# EAGLE board KickerBoard-new (EAGLE 9.3.0), part 1 of 2
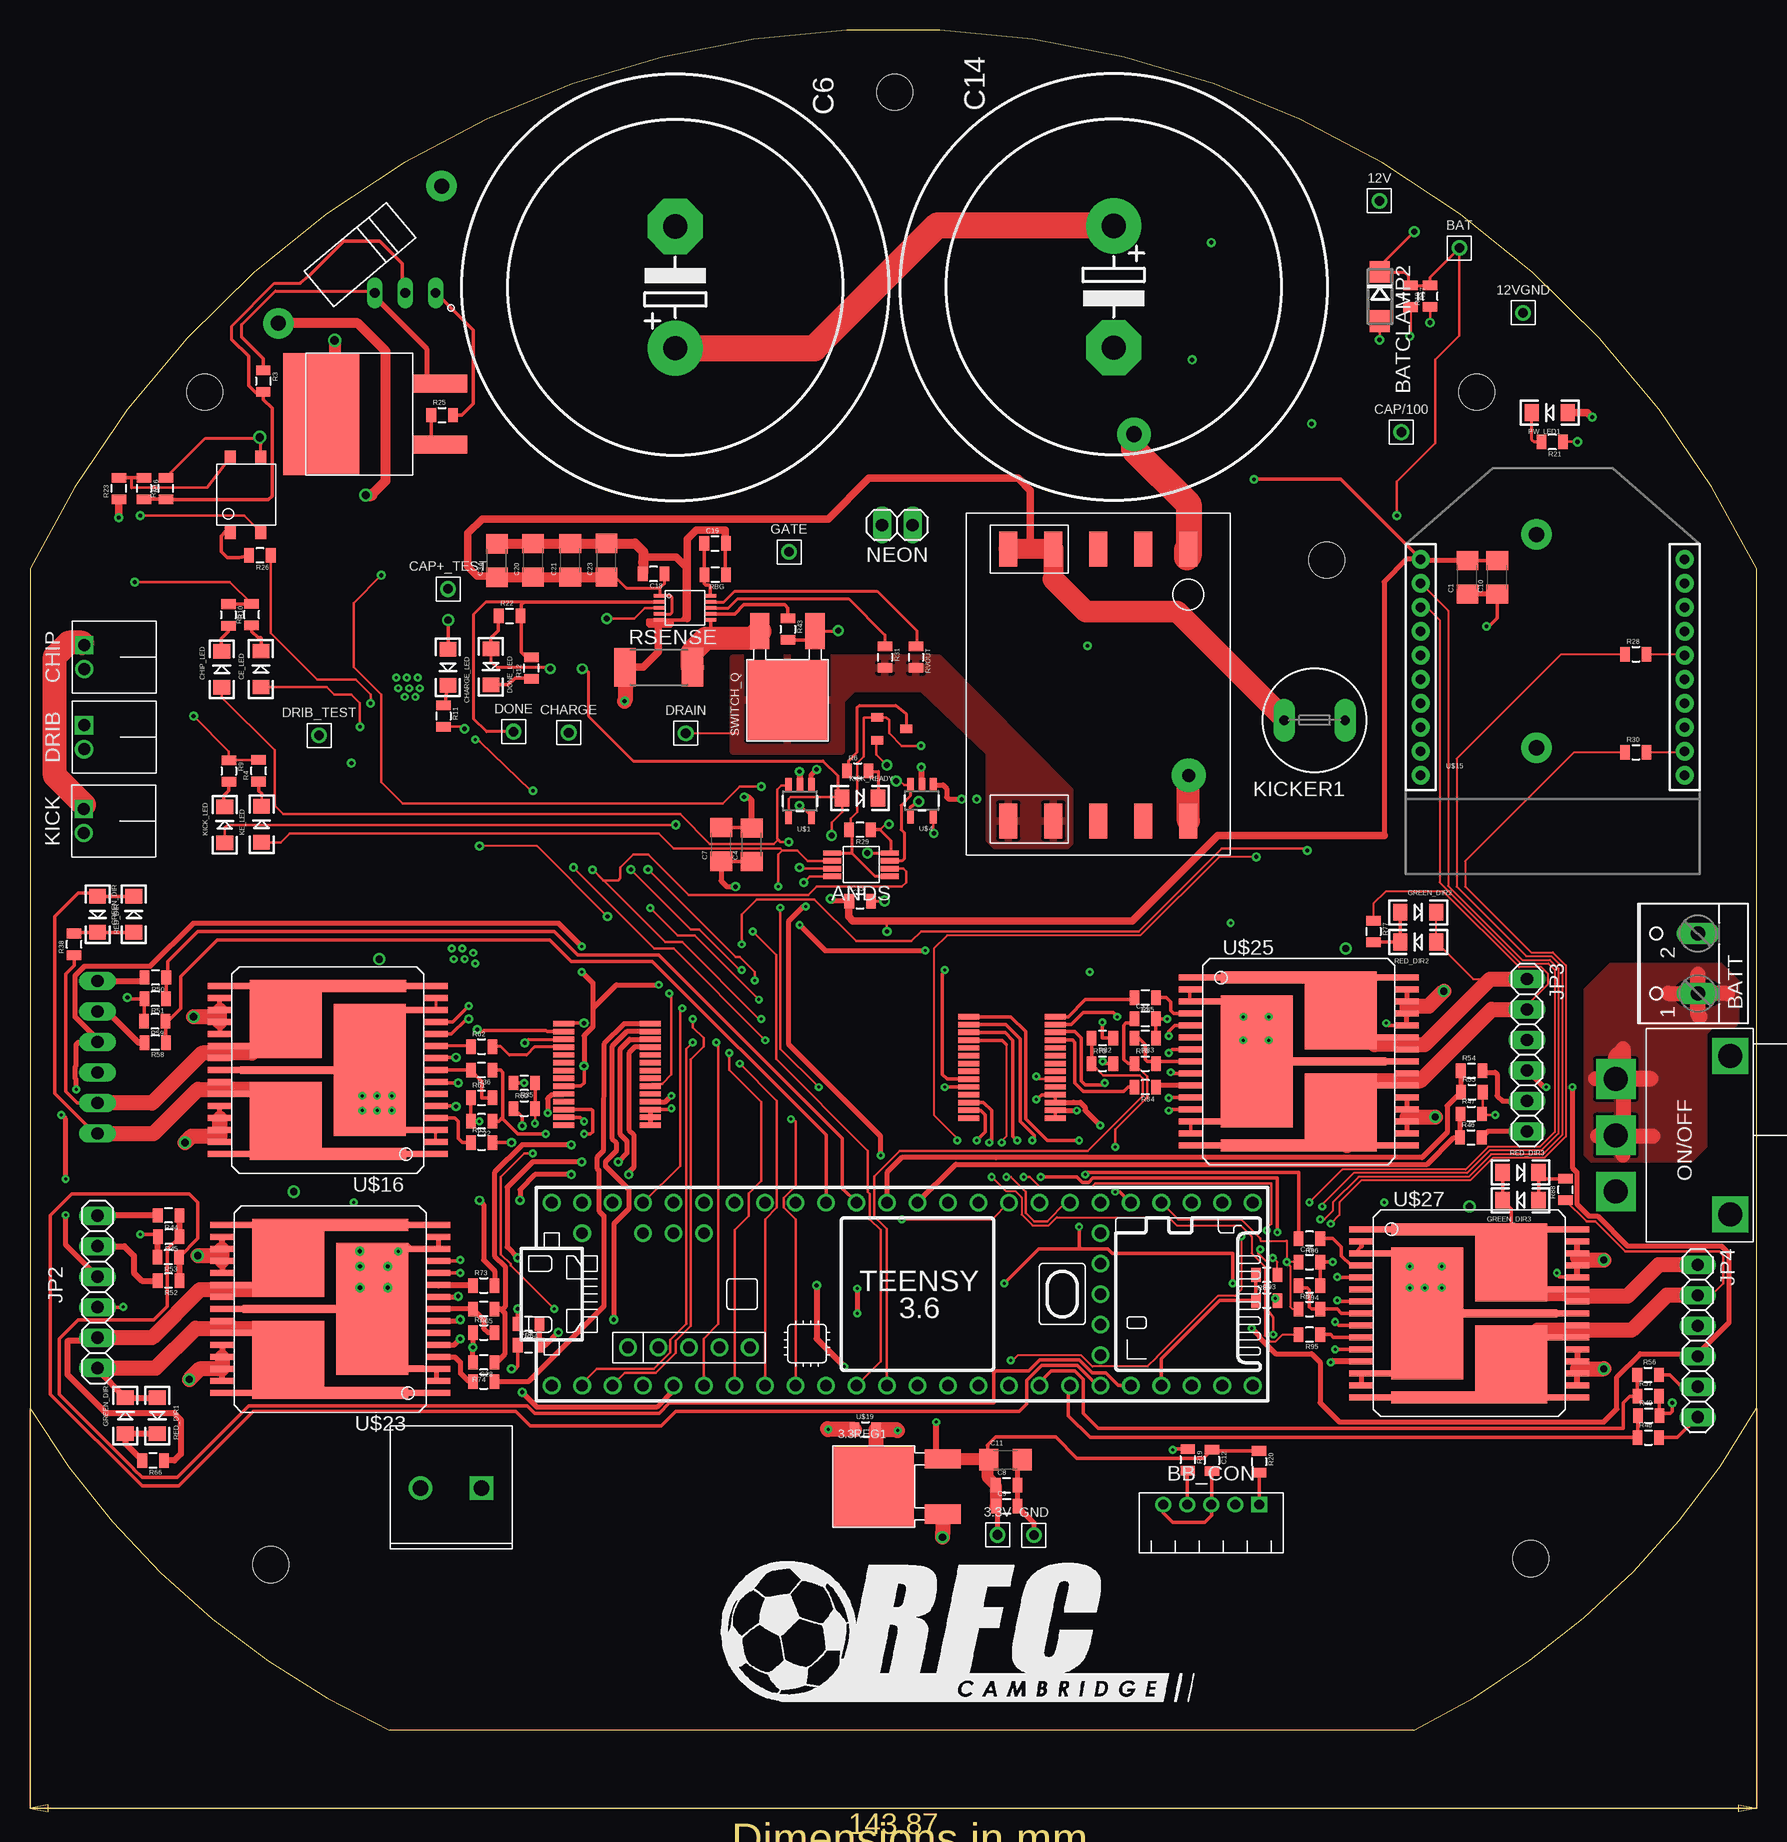
[diagram p3: board, top side]
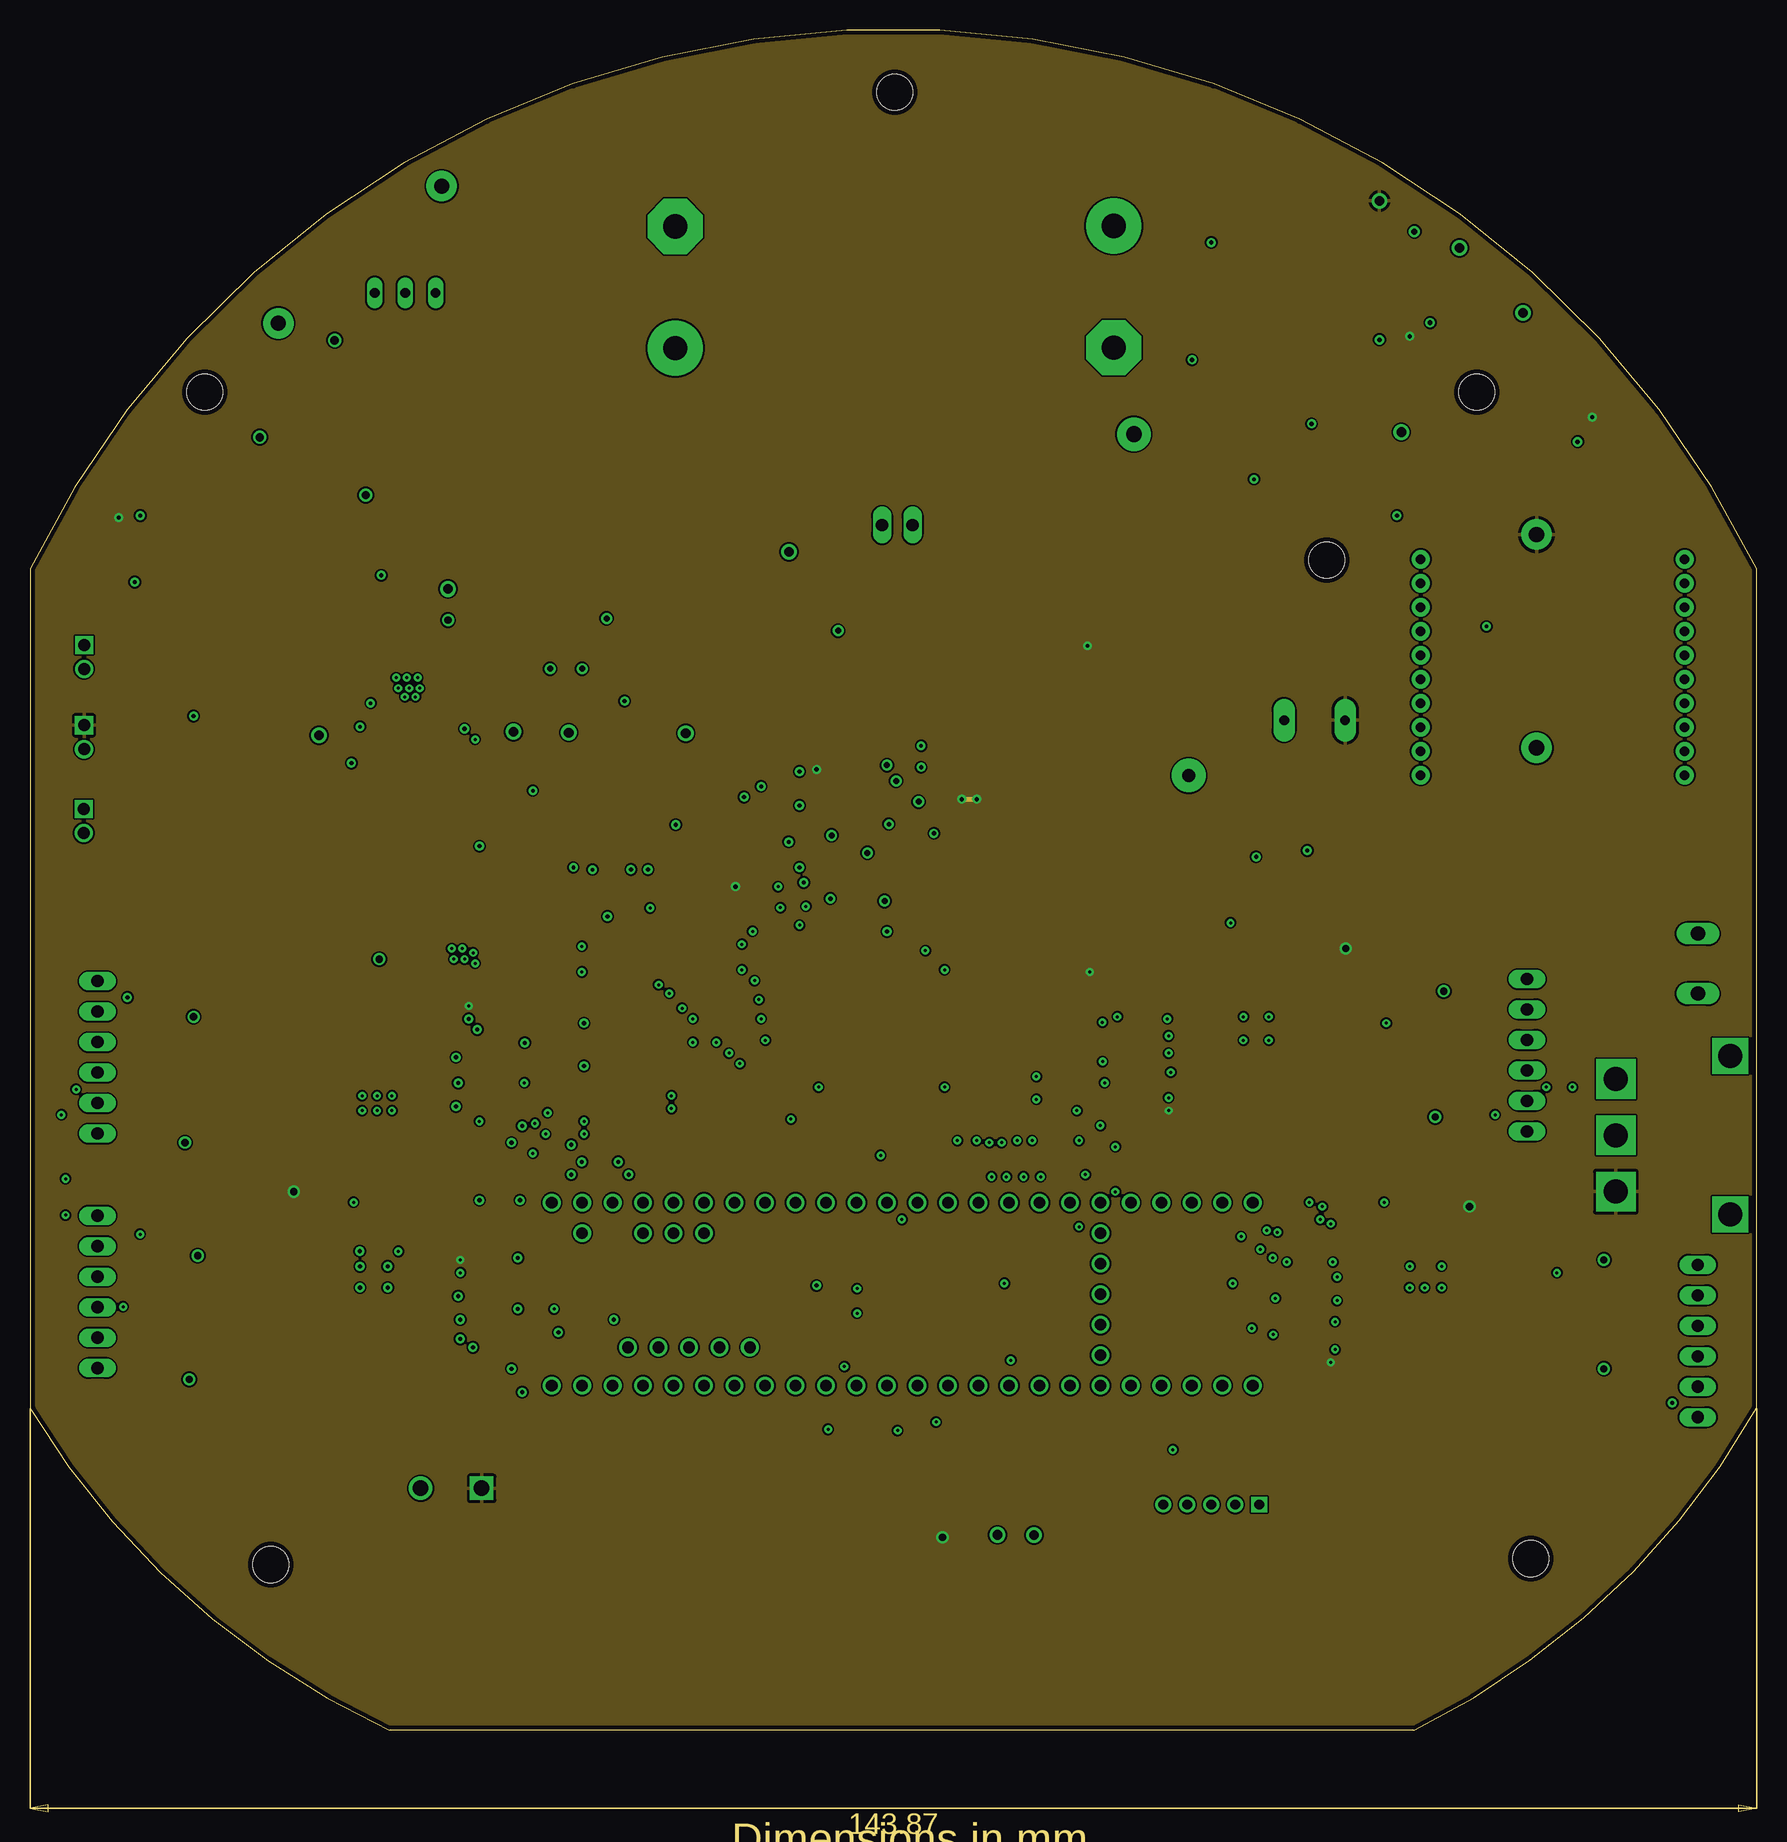
[diagram p4: board, inner layer 12V+]
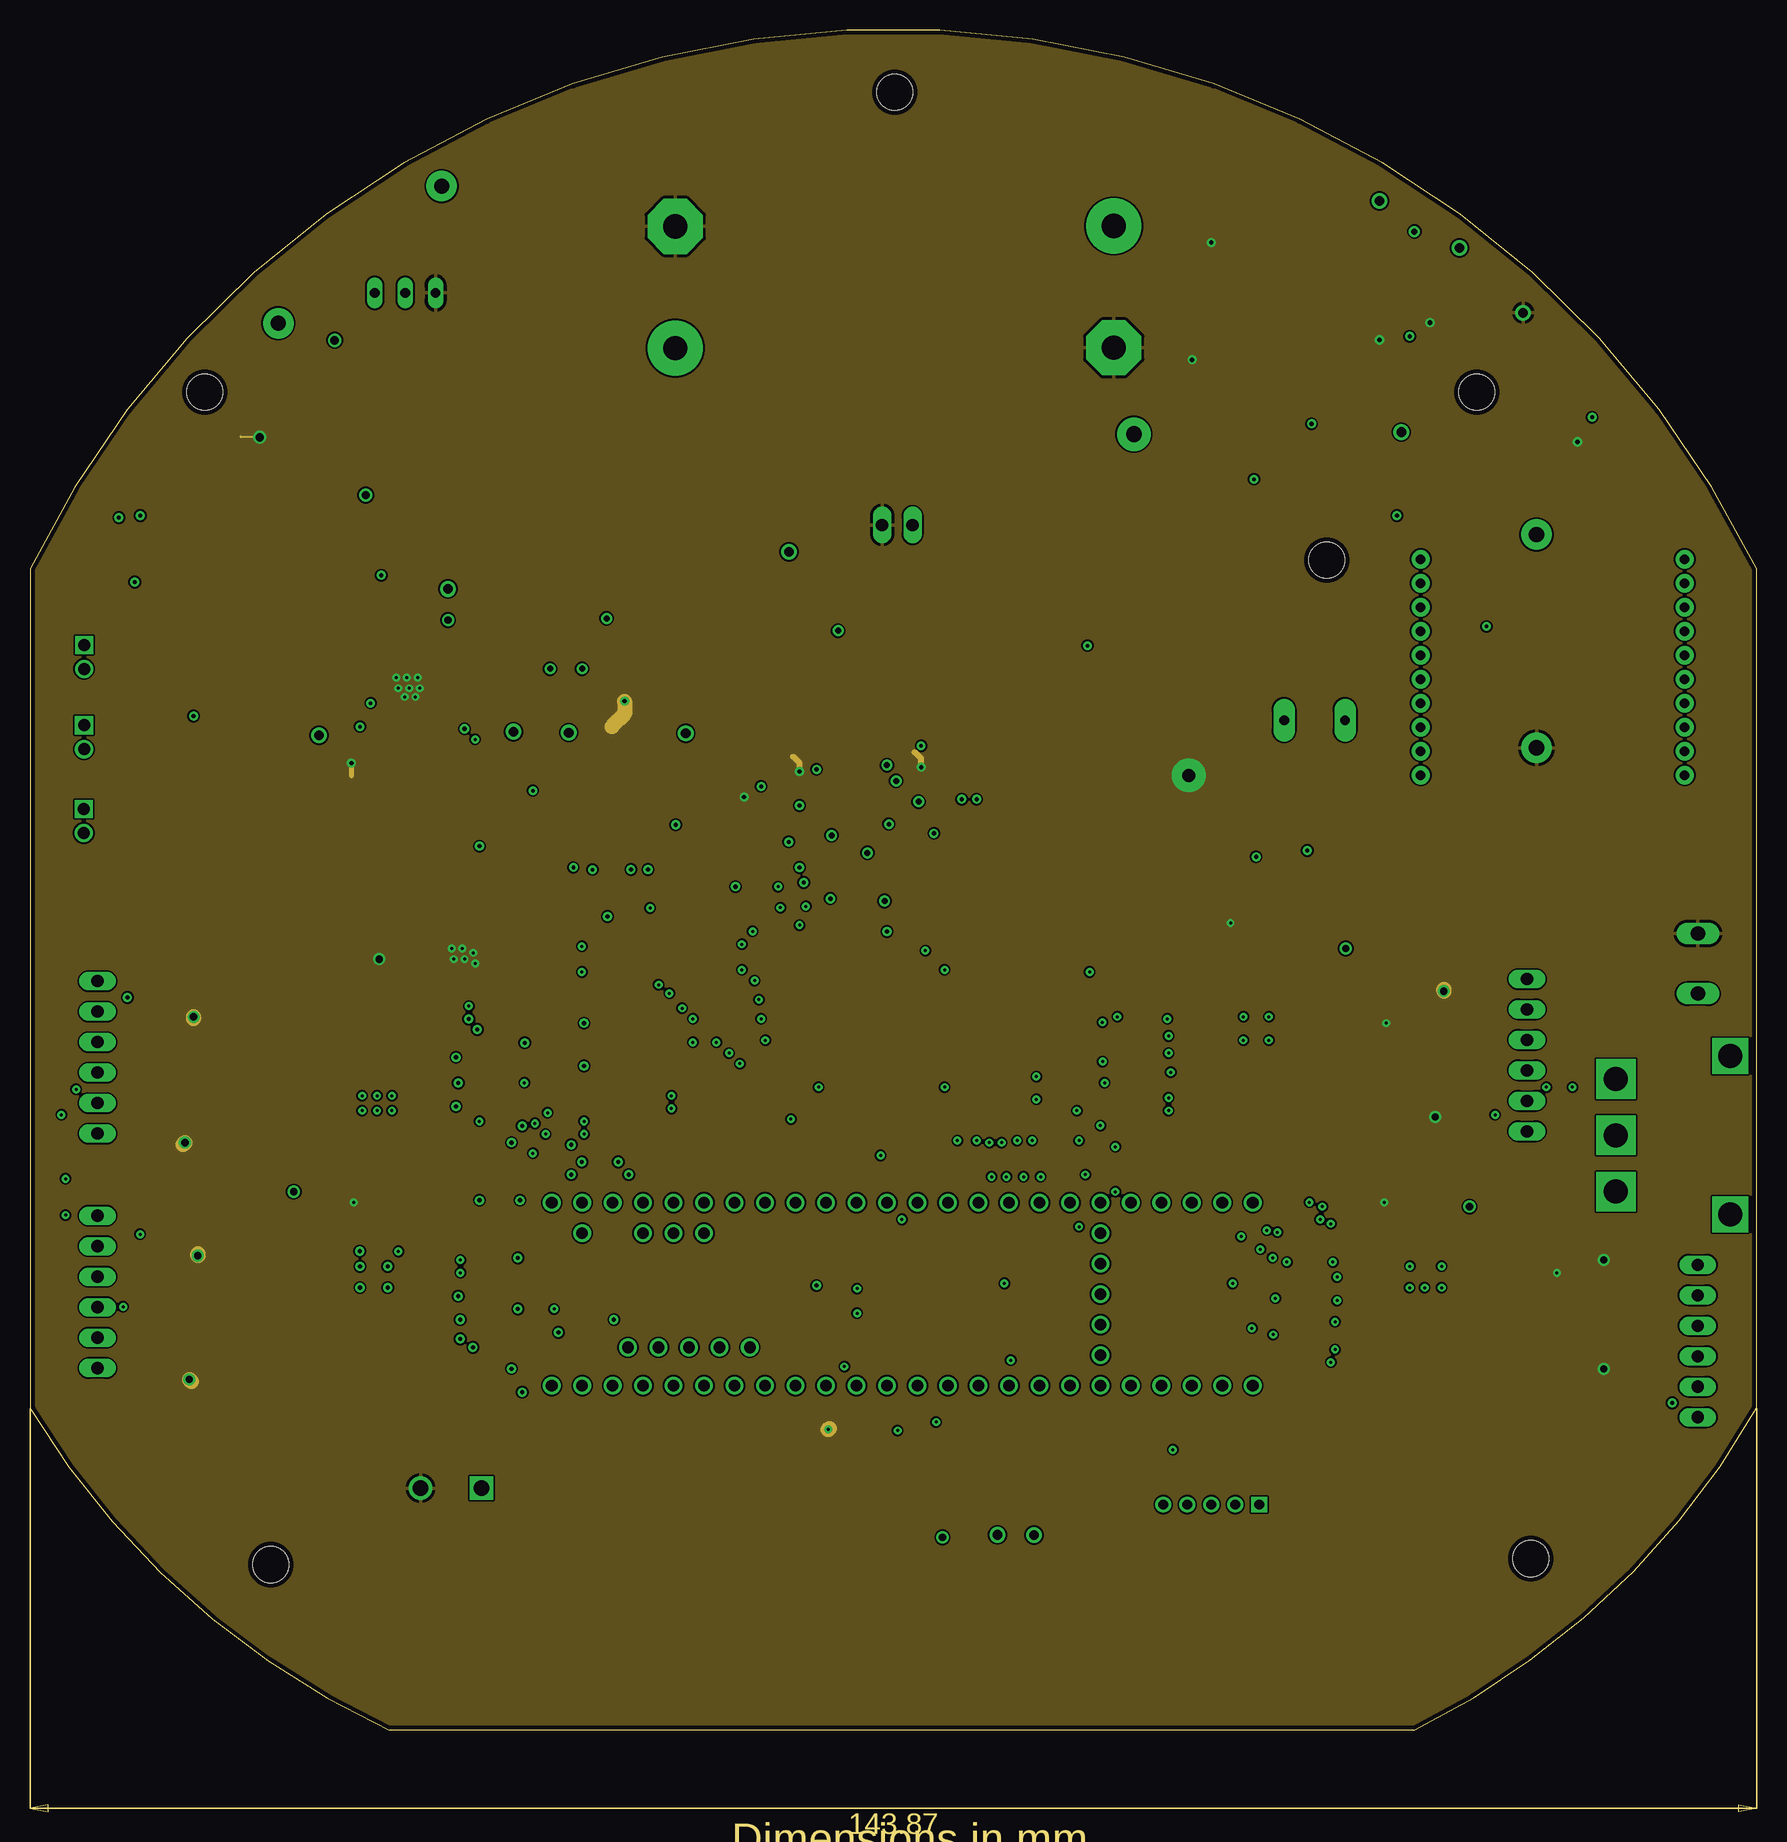
[diagram p5: board, inner layer 12VGND]
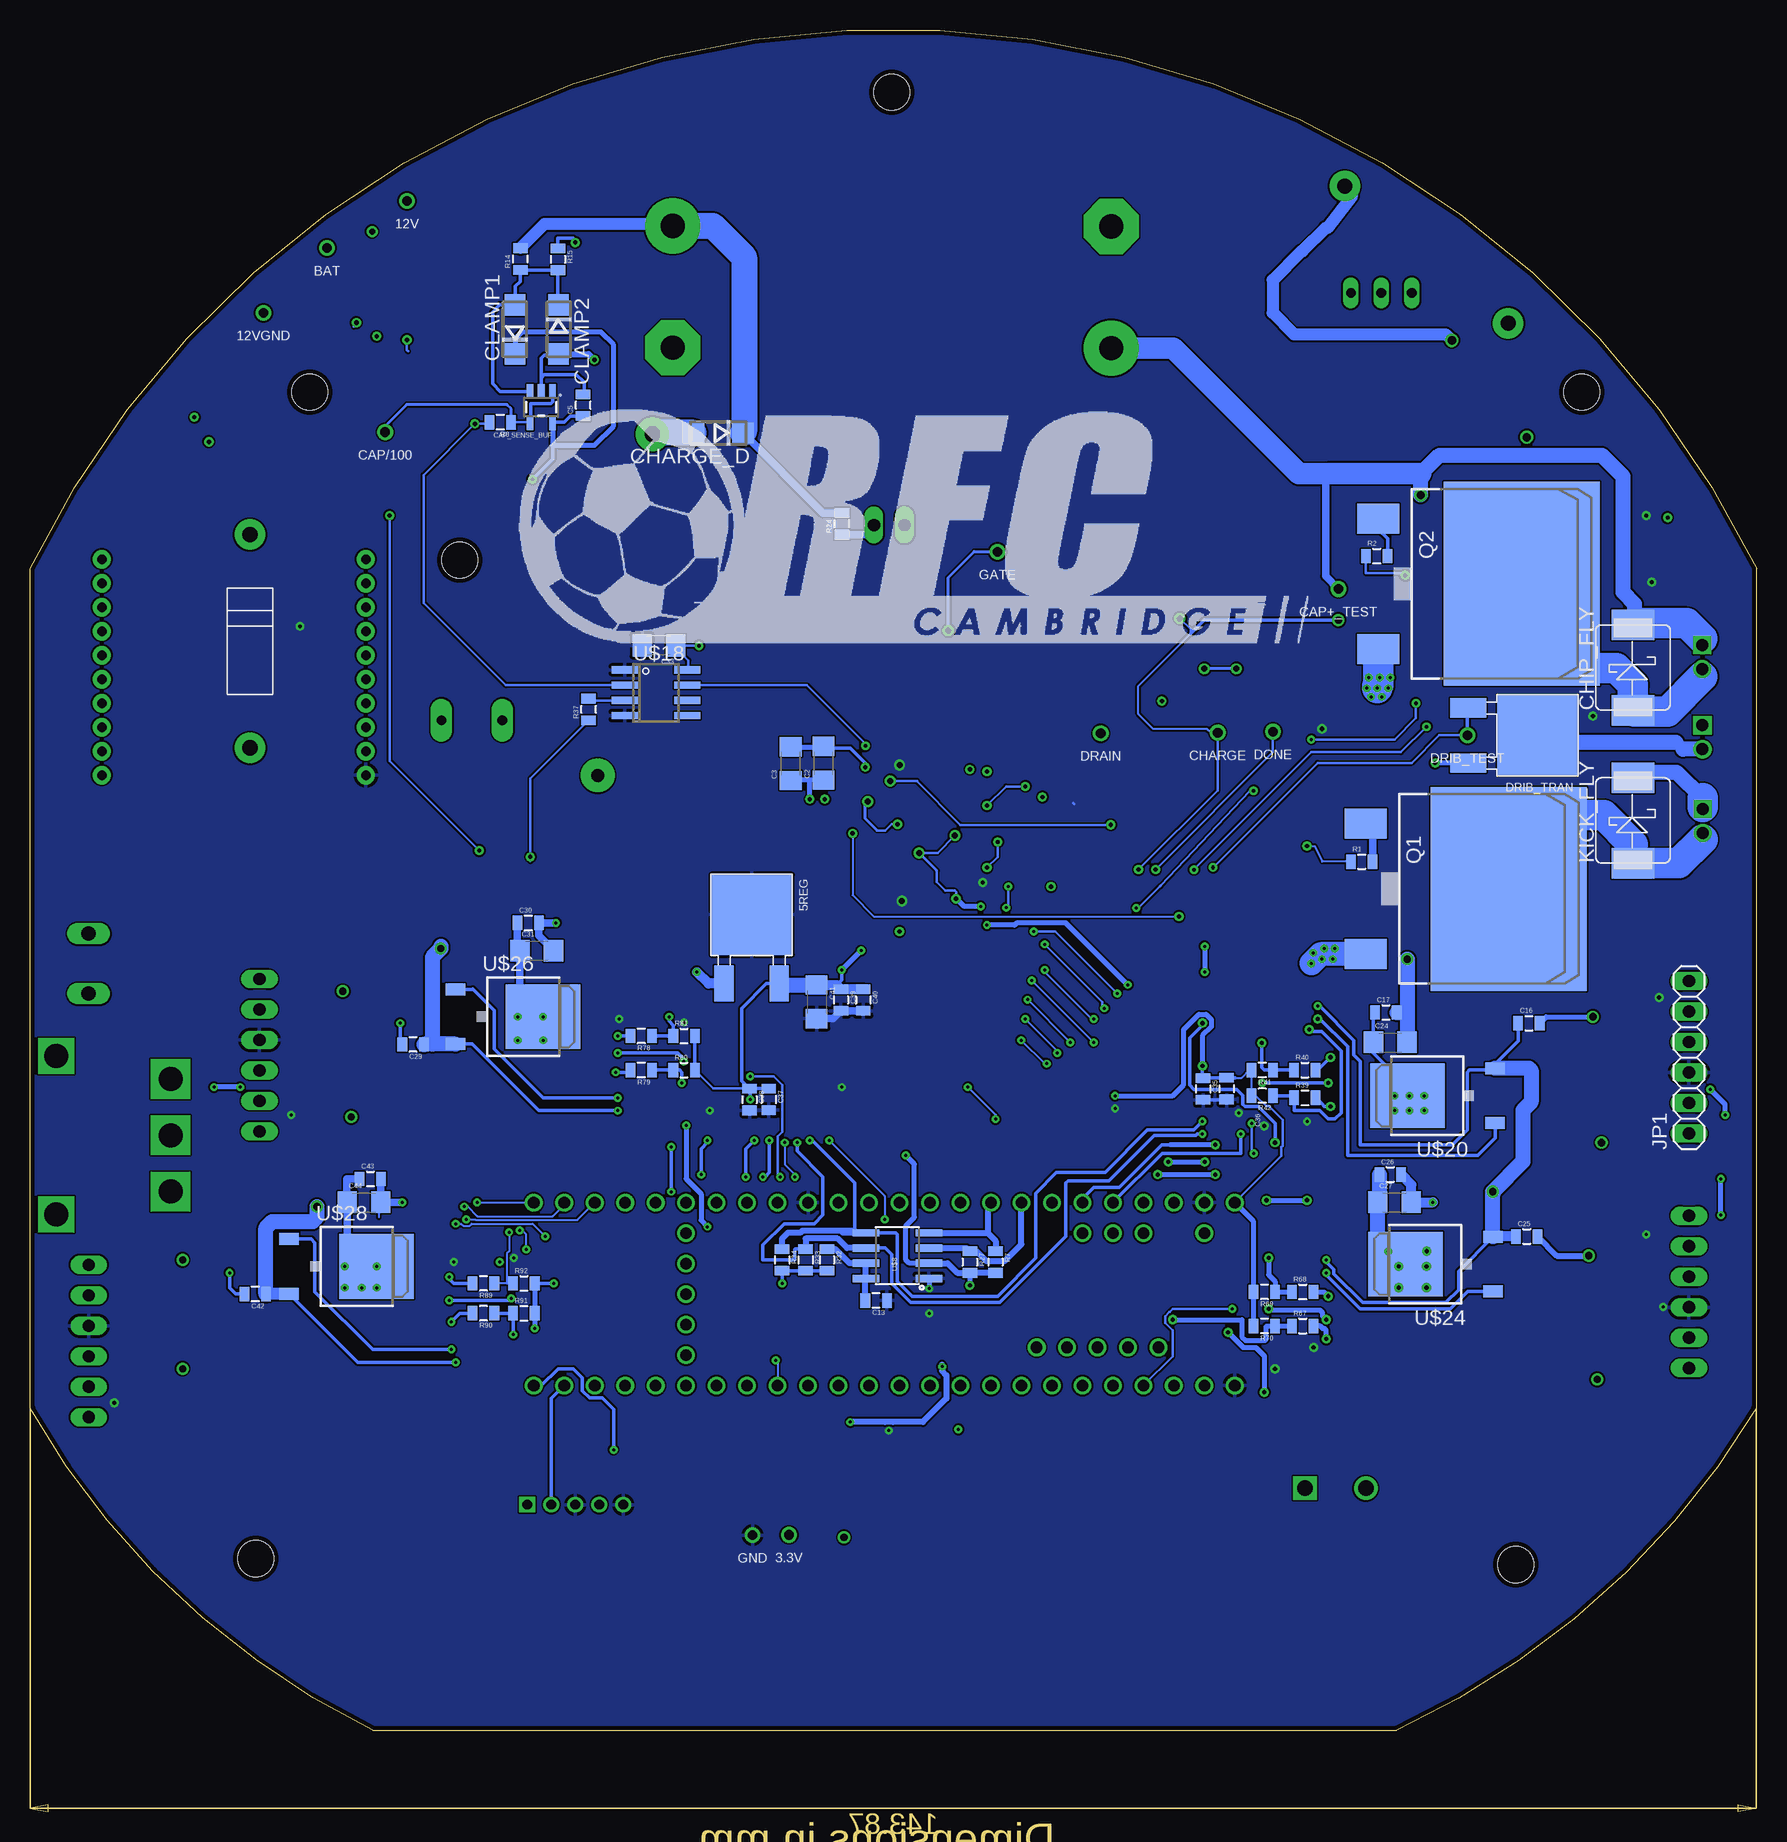
[diagram p6: board, bottom side, seen from below]

Size 143.88 x 141.72 mm. Coordinates in mm from the lower left corner, seen from the top.
Outline: 143.88,26.82 143.88,96.81 arc128 0,96.81 0,26.82 arc34 29.98,0 115.32,0 arc34 143.88,26.82
Copper layers (1*2*3*16): Top(3v3+) 0.035559375mm / dielectric 0.62mm / 12V+ 0.035559375mm / dielectric 0.62mm / 12VGND 0.035559375mm / dielectric 0.62mm / Bottom(3v3GND) 0.035559375mm
Design rules "typical_4pcb *": minimum track width 6mil, minimum drill 8mil, track to track 6mil, track to pad 6mil, pad to pad 6mil, via to via 6mil, smd to smd 6mil, copper to edge 15mil, drill to drill 8mil, minimum pad ring 10mil, minimum via ring 8mil, stop-mask expansion 4mil, vias tented up to drill 0mil, thermal gap 10mil
Holes 3 mm at 125.07,14.3 20.07,13.8 14.57,111.52 72.07,136.52 108.07,97.52 120.57,111.52

## Footprints (pad centres in the part's own frame; a part is rotated, then mirrored left to right if it is on the bottom)
DPAK = smd 6.7 x 6.7: DRAIN 0,0 | smd 3 x 1.6: GATE 5.75,-2.3; SOURCE 5.75,2.3
TESTING_PT = drill 0.8: P$1 0,0
TSSOP8 = smd 1.5 x 0.45: P$1 -2.4,0.975; P$2 -2.4,0.325; P$3 -2.4,-0.325; P$4 -2.4,-0.975; P$5 2.4,-0.975; P$6 2.4,-0.325; P$7 2.4,0.325; P$8 2.4,0.975
DO214AC = smd 1.8 x 1.7: A 2.05,0; C -2.05,0
W237-102 = drill 1.194 long: 1 -2.5,-1.27; 2 2.5,-1.27
JST-5-2MM = drill 0.8 square: 1 4,0 | drill 0.8: 2 2,0; 3 0,0; 4 -2,0; 5 -4,0
1206 = smd 1.6 x 1.8: 1 -1.4,0; 2 1.4,0
0805 = smd 0.8 x 1.2: 1 -0.9,0; 2 0.9,0
EB35D = drill 2.007 pad 4.597: + -5.08,0 | drill 2.007 pad 4.597 octagon: - 5.08,0
SOT23-5 = smd 0.55 x 1.2: 1 -0.95,-1.3; 2 0,-1.3; 3 0.95,-1.3; 4 0.95,1.3; 5 -0.95,1.3
LED-1206 = smd 1.2 x 1.4: A -1.5,0; C 1.5,0
10-MSOP = smd 0.97 x 0.31: P$1 -0.485,-0.155; P$2 -0.485,-0.655; P$3 -0.485,-1.155; P$4 -0.485,-1.655; P$5 -0.485,-2.155; P$6 3.785,-2.155; P$7 3.785,-1.655; P$8 3.785,-1.155; P$9 3.785,-0.655; P$10 3.785,-0.155
JST-2-2MM = drill 1 square: 1 1,1 | drill 1: 2 -1,1
DO214AB = smd 2.54 x 3.556: ANODE 0,3.111; CATHODE 7.112,3.111
1X06 = drill 1.016 long: 1 -6.35,0; 2 -3.81,0; 3 -1.27,0; 4 1.27,0; 5 3.81,0; 6 6.35,0
TR5 = drill 0.813 pad 1.778 long: 1 -2.54,0; 2 2.54,0
1X02 = drill 1.016 long: 1 -1.27,0; 2 1.27,0
CK_SWITCH = drill 2 pad 3.302 square: COM 0,0; IN1 4.699,0; IN2 -4.699,0 | drill 2 pad 2.54 square: SUP1 -6.604,-9.525; SUP2 6.604,-9.525
TO268 = smd 8.5 x 13: C@1 -4.25,2.25; C@2 4.25,2.25 | smd 2.5 x 3.5: E 5.45,-9.7; G -5.45,-9.7
R2512 = smd 1.8 x 3.2: 1 -2.8,0; 2 2.8,0
TO-263 = smd 1.524 x 4.572: LOWER_LEFT 2.54,-2.286; LOWER_RIGHT 7.62,-2.286 | smd 10.16 x 6.35: TAB 5.08,7.62
10-TRANSFORMER = smd 2.92 x 1.52: P$1 0,0; P$2 0,-3.75; P$3 0,-7.5; P$4 0,-11.25; P$5 0,-15; P$6 22.67,-15; P$7 22.67,-11.25; P$8 22.67,-7.5; P$9 22.67,-3.75; P$10 22.67,0
SOP4 = smd 0.889 x 1.143: 1 0.813,-0.584; 2 3.353,-0.584; 3 3.353,5.664; 4 0.813,5.639
TO92 = drill 0.8 long: CENTER 2.54,0; LEFT 0,0; RIGHT 5.08,0
THROUGH-HOLE-2 = drill 1.27 pad 2.54: + 0,0; - 17.78,0
SOIC8 = smd 0.61 x 2.21: 1 -1.905,-2.616; 2 -0.635,-2.616; 3 0.635,-2.616; 4 1.905,-2.616; 5 1.905,2.616; 6 0.635,2.616; 7 -0.635,2.616; 8 -1.905,2.616
1X02-PHEONIX = drill 1.3 square: 1 0,0 | drill 1.3: 2 5.08,0
TEENSY_3.5/3.6 = drill 0.965: 0/RX -25.4,-7.62; 1/TX -22.86,-7.62; 2 -20.32,-7.62; 3/CANTX -17.78,-7.62; 3V3 7.62,-7.62; 3V3_2 17.78,-2.54; 3V3_LO -22.86,7.62; 4/CANRX -15.24,-7.62; 5 -12.7,-7.62; 6 -10.16,-7.62; 7 -7.62,-7.62; 8 -5.08,-7.62; 9/CS -2.54,-7.62; 10/CS 0,-7.62; 11/MOSI 2.54,-7.62; 12/MISO 5.08,-7.62; 13/SCK 5.08,7.62; 14/A0 2.54,7.62; 15/A1 0,7.62; 16/A2 -2.54,7.62; 17/A3 -5.08,7.62; 18/A4/SDA -7.62,7.62; 19/A5/SCL -10.16,7.62; 20/A6 -12.7,7.62; 21/A7 -15.24,7.62; 21/DAC0 12.7,7.62; 22/A8 -17.78,7.62; 23/A9 -20.32,7.62; 24 10.16,-7.62; 25 12.7,-7.62; 26 15.24,-7.62; 27 17.78,-7.62; 28 20.32,-7.62; 29 22.86,-7.62; 30 25.4,-7.62; 31/A12 27.94,-7.62; 32/A13 30.48,-7.62; 33/A14 30.48,7.62; 34/A15 27.94,7.62; 35/A16 25.4,7.62; 36/A17 22.86,7.62; 37/A18 20.32,7.62; 38/A19 17.78,7.62; 39/A20 15.24,7.62; A10 -17.78,5.08; A11 -15.24,5.08; A22/DAC1 10.16,7.62; AGND -25.4,7.62; AREF -20.32,5.08; GND -27.94,-7.62; GND2 7.62,7.62; GND3 17.78,0; PROG 17.78,2.54; RESET 17.78,5.08; U5V -21.59,-4.445; UD+ -16.51,-4.445; UD- -19.05,-4.445; UGND1 -13.97,-4.445; UGND2 -11.43,-4.445; VBAT 17.78,-5.08; VIN -27.94,7.62; VUSB -25.4,5.08
XBEE-1 = drill 0.8 pad 1.524: 1 -11,20; 2 -11,18; 3 -11,16; 4 -11,14; 5 -11,12; 6 -11,10; 7 -11,8; 8 -11,6; 9 -11,4; 10 -11,2; 11 11,2; 12 11,4; 13 11,6; 14 11,8; 15 11,10; 16 11,12; 17 11,14; 18 11,16; 19 11,18; 20 11,20
MULTIPOWERSO-30 = smd 0.508 x 12: 1 -7,-4; 15 7,-4; 16 7,4; 30 -7,4 | smd 0.508 x 2: 2 -6,-9; 4 -4,-9; 5 -3,-9; 6 -2,-9; 7 -1,-9; 8 0,-9; 9 1,-9; 10 2,-9; 11 3,-9; 12 4,-9; 14 6,-9; 17 6,9; 18 5,9; 19 4,9; 20 3,9; 22 1,9; 24 -1,9; 26 -3,9; 27 -4,9; 28 -5,9; 29 -6,9 | smd 0.508 x 4: 3 -5,-8; 13 5,-8; 21 2,8; 23 0,8; 25 -2,8 | smd 6.5 x 6: OUTA -4.25,3.5; OUTB 4.25,3.5 | smd 1 x 7.5: OUTA@1 -7,-2.755; OUTB@1 7,-2.755 | smd 11 x 6: VCC 0,-3.5 | smd 0.65 x 8.3: VCC@1 0,3.145
SSOP = smd 0.45 x 1.75: 1 0,0; 2 0.65,0; 3 1.3,0; 4 1.95,0; 5 2.6,0; 6 3.25,0; 7 3.9,0; 8 4.55,0; 9 5.2,0; 10 5.85,0; 11 6.5,0; 12 7.15,0; 13 7.8,0; 14 8.45,0; 15 8.45,7.2; 16 7.8,7.2; 17 7.15,7.2; 18 6.5,7.2; 19 5.85,7.2; 20 5.2,7.2; 21 4.55,7.2; 22 3.9,7.2; 23 3.25,7.2; 24 2.6,7.2; 25 1.95,7.2; 26 1.3,7.2; 27 0.65,7.2; 28 0,7.2
SOIC8' = smd 0.6 x 2.2: 1 -1.905,-2.6; 2 -0.635,-2.6; 3 0.635,-2.6; 4 1.905,-2.6; 5 1.905,2.6; 6 0.635,2.6; 7 -0.635,2.6; 8 -1.905,2.6
TO252-3 = smd 1 x 1.6: 1 -2.28,-6.07; 2 2.28,-6.07 | smd 5.4 x 6.2: 3 0,1.23
SOT-23 = smd 1 x 0.7: D 0,0; G -2.4,0.95; S -2.4,-0.95

## Placement (x,y rotation side)
3.3REG1  3.3REG1AREG  [DPAK]  70.31,20.31 0 top
3.3V  TEST_PT  [TESTING_PT]  80.63,16.28 0 top
5REG  3.3REG1AREG  [DPAK]  83.73,67.97 270 bottom
12V  TEST_PT  [TESTING_PT]  112.46,127.47 0 top
12VGND  TEST_PT  [TESTING_PT]  124.43,118.15 0 top
ANDS  AND-DUAL  [TSSOP8]  69.25,72.14 0 top
BAT  TEST_PT  [TESTING_PT]  119.12,123.54 0 top
BATCLAMP2  DIODE-ZENERDO214AC  [DO214AC]  112.48,119.5 270 top
BATT  [W237-102]  137.72,63.91 90 top
BB_CON  JST-5  [JST-5-2MM]  98.43,18.79 0 top
C1  1uF  [1206]  119.78,96.09 90 top
C2  .1uF  [1206]  77.74,80.61 90 bottom
C3  10uF  [1206]  80.48,80.56 90 bottom
C4  .1uF  [1206]  60.15,73.81 90 top
C5  .1uF  [0805]  97.78,110.45 90 bottom
C6  1500uF  [EB35D]  53.78,120.27 90 top
C7  10uF  [1206]  57.6,73.83 90 top
C8  1uF  [0805]  81.38,20.42 0 top
C9  .01uF  [0805]  81.39,18.66 0 top
C10  .01uF  [1206]  122.27,96.09 90 top
C11  47uF  [1206]  81.29,22.56 0 top
C12  4.7uF  [0805]  98.49,22.48 270 top
C13  100nF  [0805]  73.37,35.82 180 bottom
C14  1500uF  [EB35D]  90.31,120.31 270 top
C15  .1uF  [0805]  69.17,69.1 0 top
C16  0.1uF  [0805]  18.96,58.93 0 bottom
C17  0.1uF  [0805]  30.88,59.82 0 bottom
C18  10uF  [0805]  51.96,96.38 180 top
C19  100pF  [0805]  57.09,98.92 0 top
C20  47uF  [1206]  41.93,97.51 90 top
C21  47uF  [1206]  45.02,97.52 90 top
C22  33nF  [0805]  37.63,50.75 180 top
C23  47uF  [1206]  48.04,97.52 90 top
C24  47uF  [1206]  30.52,57.33 0 bottom
C25  0.1uF  [0805]  19.14,41.15 0 bottom
C26  0.1uF  [0805]  30.52,46.31 0 bottom
C27  47uF  [1206]  30.17,44 0 bottom
C28  33nF  [0805]  37.81,30.66 180 top
C29  0.1uF  [0805]  111.95,57.15 180 bottom
C30  0.1uF  [0805]  102.35,67.29 0 bottom
C31  47uF  [1206]  101.64,64.98 0 bottom
C32  33nF  [0805]  92.93,59.29 0 top
C33  1uF  [1206]  91.47,90.41 180 bottom
C34  47uF  [1206]  38.9,97.49 90 top
C35  100nF  [0805]  46.12,53.45 270 bottom
C36  2.2uF  [0805]  44.16,53.47 270 bottom
C37  100nF  [0805]  82.31,52.58 270 bottom
C38  2.2uF  [0805]  83.91,52.56 270 bottom
C39  1uF  [0805]  76.29,60.86 270 bottom
C40  .01uF  [0805]  74.44,60.86 270 bottom
C41  47uF  [1206]  78.32,60.71 270 bottom
C42  0.1uF  [0805]  125.11,36.35 180 bottom
C43  0.1uF  [0805]  115.51,45.95 0 bottom
C44  47uF  [1206]  116.04,44 0 bottom
C45  33nF  [0805]  106.62,39.02 0 top
CAP+_TEST  TEST_PT  [TESTING_PT]  34.85,95.12 0 top
CAP/100  TEST_PT  [TESTING_PT]  114.28,108.2 0 top
CAP_SENSE_BUF  MCP6291T-E/OT  [SOT23-5]  101.27,110.28 180 bottom
CE_LED  [LED-1206]  19.24,88.45 90 top
CHARGE  TEST_PT  [TESTING_PT]  44.9,83.15 0 top
CHARGE_D  1kV, ultrafast  [DO214AC]  86.52,108.14 180 bottom
CHARGE_LED  [LED-1206]  34.83,88.6 270 top
CHARGE_U  LT3750  [10-MSOP]  52.93,94.7 0 top
CHIP  JST-22MM  [JST-2-2MM]  5.51,89.46 90 top
CHIP_FLY  DIODE-ZENERDO214AB  [DO214AB]  7.19,85.02 90 bottom
CHIP_LED  [LED-1206]  15.99,88.43 90 top
CLAMP1  DIODE-ZENERDO214AC  [DO214AC]  103.45,116.75 90 bottom
CLAMP2  DIODE-ZENERDO214AC  [DO214AC]  99.84,116.76 270 bottom
DONE  TEST_PT  [TESTING_PT]  40.3,83.23 0 top
DONE_LED  [LED-1206]  38.41,88.65 270 top
DRAIN  TEST_PT  [TESTING_PT]  54.65,83.11 0 top
DRIB  JST-22MM  [JST-2-2MM]  5.5,82.76 90 top
DRIB_TEST  TEST_PT  [TESTING_PT]  24.09,82.92 0 top
DRIB_TRAN  [DPAK]  18.26,82.92 180 bottom
GATE  TEST_PT  [TESTING_PT]  63.25,98.21 0 top
GND  TEST_PT  [TESTING_PT]  83.66,16.26 0 top
GREEN_DIR  [LED-1206]  8.65,68 90 top
GREEN_DIR1  [LED-1206]  7.94,26.22 90 top
GREEN_DIR2  [LED-1206]  115.69,68.18 0 top
GREEN_DIR3  [LED-1206]  124.22,44.17 180 top
JP1  [1X06]  5.63,56.09 90 bottom
JP2  [1X06]  5.63,36.53 90 top
JP3  [1X06]  124.76,56.26 270 top
JP4  [1X06]  138.98,32.44 270 top
KE_LED  [LED-1206]  19.3,75.51 90 top
KICK  JST-22MM  [JST-2-2MM]  5.49,75.79 90 top
KICK_FLY  DIODE-ZENERDO214AB  [DO214AB]  7.19,72.28 90 bottom
KICK_LED  [LED-1206]  16.23,75.47 90 top
KICK_READY  [LED-1206]  69.18,77.69 0 top
KICKER1  [TR5]  107.05,84.19 180 top
NEON  [1X02]  72.28,100.46 180 top
ON/OFF  SPDT-SWITCH  [CK_SWITCH]  132.15,49.59 90 top
PW_LED1  [LED-1206]  126.64,109.83 180 top
Q1  IXFT94N30P3  [TO268]  22.88,70.13 270 bottom
Q2  IXFT94N30P3  [TO268]  21.81,95.56 270 bottom
R1  100  [0805]  32.89,72.39 0 bottom
R2  100  [0805]  31.65,97.87 0 bottom
R3  250k  [0805]  19.44,112.45 270 top
R4  1k  [0805]  19.05,79.97 90 top
R5  1k  [0805]  18.47,93 90 top
R6  1k  [0805]  68.99,79.98 0 top
R7  4.7k  [0805]  63.41,39.02 270 bottom
R8  1k  [0805]  104.69,109.02 180 bottom
R9  1k  [0805]  16.58,79.94 270 top
R10  1k  [0805]  16.53,92.97 270 top
R11  1k  [0805]  34.45,84.53 270 top
R12  1k  [0805]  41.79,88.54 90 top
R13  2.5k  [0805]  11.33,103.5 90 top
R14  1M  [0805]  103.01,122.64 90 bottom
R15  10K  [0805]  99.88,122.6 270 bottom
R16  1k  [0805]  9.5,103.5 270 top
R17  80k  [0805]  115.05,119.52 270 top
R18  20k  [0805]  116.68,119.54 90 top
R19  20  [0805]  96.48,22.54 270 top
R20  100  [0805]  102.42,22.38 270 top
R21  1k  [0805]  126.85,107.37 180 top
R22  100k  [0805]  39.97,92.88 0 top
R23  1.5k  [0805]  7.4,103.5 90 top
R24  536k  [0805]  76.22,100.56 90 bottom
R25  200  [0805]  34.34,109.61 0 top
R26  300  [0805]  19.16,97.93 180 top
R27  4.7k  [0805]  65.55,39.02 270 bottom
R28  0  [0805]  133.82,89.69 0 top
R29  1M  [0805]  69.16,75.05 180 top
R30  0  [0805]  133.82,81.51 0 top
R31  43k  [0805]  71.25,89.44 270 top
R32  200k  [0805]  77.46,39.2 270 bottom
R33  4.7k  [0805]  79.24,39.2 270 bottom
R34  4.7k  [0805]  81.19,39.2 270 bottom
R35  1k  [0805]  41.19,53.95 180 top
R36  10k  [0805]  37.63,55.02 180 top
R37  100k  [0805]  97.32,85.09 90 bottom
R38  4.7k  [0805]  3.67,65.51 90 top
R39  1k  [0805]  37.63,52.71 0 bottom
R40  1k  [0805]  37.63,55.02 0 bottom
R41  1k  [0805]  41.19,55.02 180 bottom
R42  1k  [0805]  41.19,52.89 180 bottom
R43  100  [0805]  63.16,91.77 270 top
R44  39k  [0805]  11.55,42.9 180 top
R45  75k  [0805]  11.57,41.13 180 top
R46  39k  [0805]  120.08,49.41 0 top
R47  75k  [0805]  120.11,51.36 0 top
R48  39k  [0805]  134.87,24.39 0 top
R49  75k  [0805]  134.89,26.22 0 top
R50  39k  [0805]  10.46,62.74 180 top
R51  75k  [0805]  10.43,60.96 180 top
R52  39k  [0805]  11.55,37.47 180 top
R53  75k  [0805]  11.52,39.42 180 top
R54  39k  [0805]  120.13,54.97 0 top
R55  75k  [0805]  120.16,53.19 0 top
R56  39k  [0805]  134.84,29.62 0 top
R57  75k  [0805]  134.87,27.84 0 top
R58  39k  [0805]  10.43,57.31 180 top
R59  75k  [0805]  10.41,59.08 180 top
R60  10k  [0805]  41.19,51.82 0 top
R61  1k  [0805]  37.63,52.71 0 top
R62  1k  [0805]  37.63,56.98 0 top
R63  1k  [0805]  37.63,48.98 0 top
R64  1k  [0805]  41.55,33.86 180 top
R65  10k  [0805]  37.81,35.11 180 top
R66  4.7k  [0805]  10.25,22.48 180 top
R67  1k  [0805]  37.81,33.68 0 bottom
R68  1k  [0805]  37.81,36.53 0 bottom
R69  1k  [0805]  41.01,36.53 180 bottom
R70  1k  [0805]  41.01,33.68 180 bottom
R71  10k  [0805]  41.55,32.08 0 top
R72  1k  [0805]  37.81,33.15 0 top
R73  1k  [0805]  37.81,37.06 0 top
R74  1k  [0805]  37.81,29.06 0 top
R75  1k  [0805]  89.37,55.55 0 top
R76  10k  [0805]  92.93,55.55 0 top
R77  4.7k  [0805]  111.95,66.58 270 top
R78  1k  [0805]  92.93,57.87 180 bottom
R79  1k  [0805]  92.93,55.02 180 bottom
R80  1k  [0805]  89.37,55.02 0 bottom
R81  1k  [0805]  89.37,57.87 0 bottom
R82  10k  [0805]  89.37,57.69 180 top
R83  1k  [0805]  92.93,57.69 180 top
R84  1k  [0805]  92.93,53.6 180 top
R85  1k  [0805]  92.93,61.07 180 top
R86  1k  [0805]  103.06,35.82 0 top
R87  10k  [0805]  106.62,35.11 0 top
R88  4.7k  [0805]  127.96,45.06 90 top
R89  1k  [0805]  106.09,37.24 180 bottom
R90  1k  [0805]  106.09,34.75 180 bottom
R91  1k  [0805]  102.71,34.75 0 bottom
R92  1k  [0805]  102.71,37.24 0 bottom
R93  10k  [0805]  103.06,37.95 180 top
R94  1k  [0805]  106.62,37.06 180 top
R95  1k  [0805]  106.62,32.97 180 top
R96  1k  [0805]  106.62,40.97 180 top
RBG  2.49k  [0805]  57.1,96.31 180 top
RED_DIR  [LED-1206]  5.63,68 270 top
RED_DIR1  [LED-1206]  10.61,26.22 270 top
RED_DIR2  [LED-1206]  115.69,65.69 180 top
RED_DIR3  [LED-1206]  124.22,46.49 0 top
RSENSE  10m  [R2512]  52.39,88.59 0 top
RVOUT  50.4k  [0805]  73.83,89.44 270 top
SWITCH_Q  [DPAK]  63.12,85.86 90 top
U$1  FAN31111  [SOT23-5]  64.17,77.45 180 top
U$2  IXTA3N50D2  [TO-263]  31.88,104.62 90 top
U$3  32052-TRANSFORMER  [10-TRANSFORMER]  96.53,98.46 270 top
U$4  FAN31111  [SOT23-5]  74.32,77.49 180 top
U$5  VO1400AEFTR  [SOP4]  15.88,100.44 0 top
U$6  ZTX718  [TO92]  33.81,119.81 180 top
U$7  1N4007  [THROUGH-HOLE-2]  20.69,117.28 40 top
U$8  PCA9306  [SOIC8]  71.59,39.55 90 bottom
U$12  13VZENER  [THROUGH-HOLE-2]  125.55,81.88 90 bottom
U$13  PHEONIX-SCREW-TERM  [1X02-PHEONIX]  37.63,20.17 180 top
U$14  TEENSY_3.5/3.6  [TEENSY_3.5/3.6]  71.42,36.35 0 top
U$15  XBEE-1B1  [XBEE-1]  126.89,77.6 0 top
U$16  VNH5019  [MULTIPOWERSO-30]  24.83,55.02 90 top
U$17  IO-EXPANDER  [SSOP]  44.49,58.88 270 top
U$18  LM311  [SOIC8']  91.71,86.48 270 bottom
U$19  INDUCTOR  [0805]  69.61,25.07 0 top
U$20  MOSFET-NCH  [TO252-3]  27.85,52.89 90 bottom
U$21  IO-EXPANDER  [SSOP]  78.25,59.47 270 top
U$22  N-FET  [SOT-23]  73.02,83.47 0 top
U$23  VNH5019  [MULTIPOWERSO-30]  25.01,35.11 90 top
U$24  MOSFET-NCH  [TO252-3]  28.03,38.84 90 bottom
U$25  VNH5019  [MULTIPOWERSO-30]  105.73,55.73 270 top
U$26  MOSFET-NCH  [TO252-3]  102.35,59.47 270 bottom
U$27  VNH5019  [MULTIPOWERSO-30]  119.96,34.75 270 top
U$28  MOSFET-NCH  [TO252-3]  116.22,38.66 270 bottom